# Altium schematic sheet hv_mux_tr_sw.SchDoc: WULPUS PRO
size A3; DrawnBy: Sergei Vostrikov; Organization: Integrated Systems Laboratory; Revision: 1.0.0; SheetNumber: 5; SheetTotal: 8
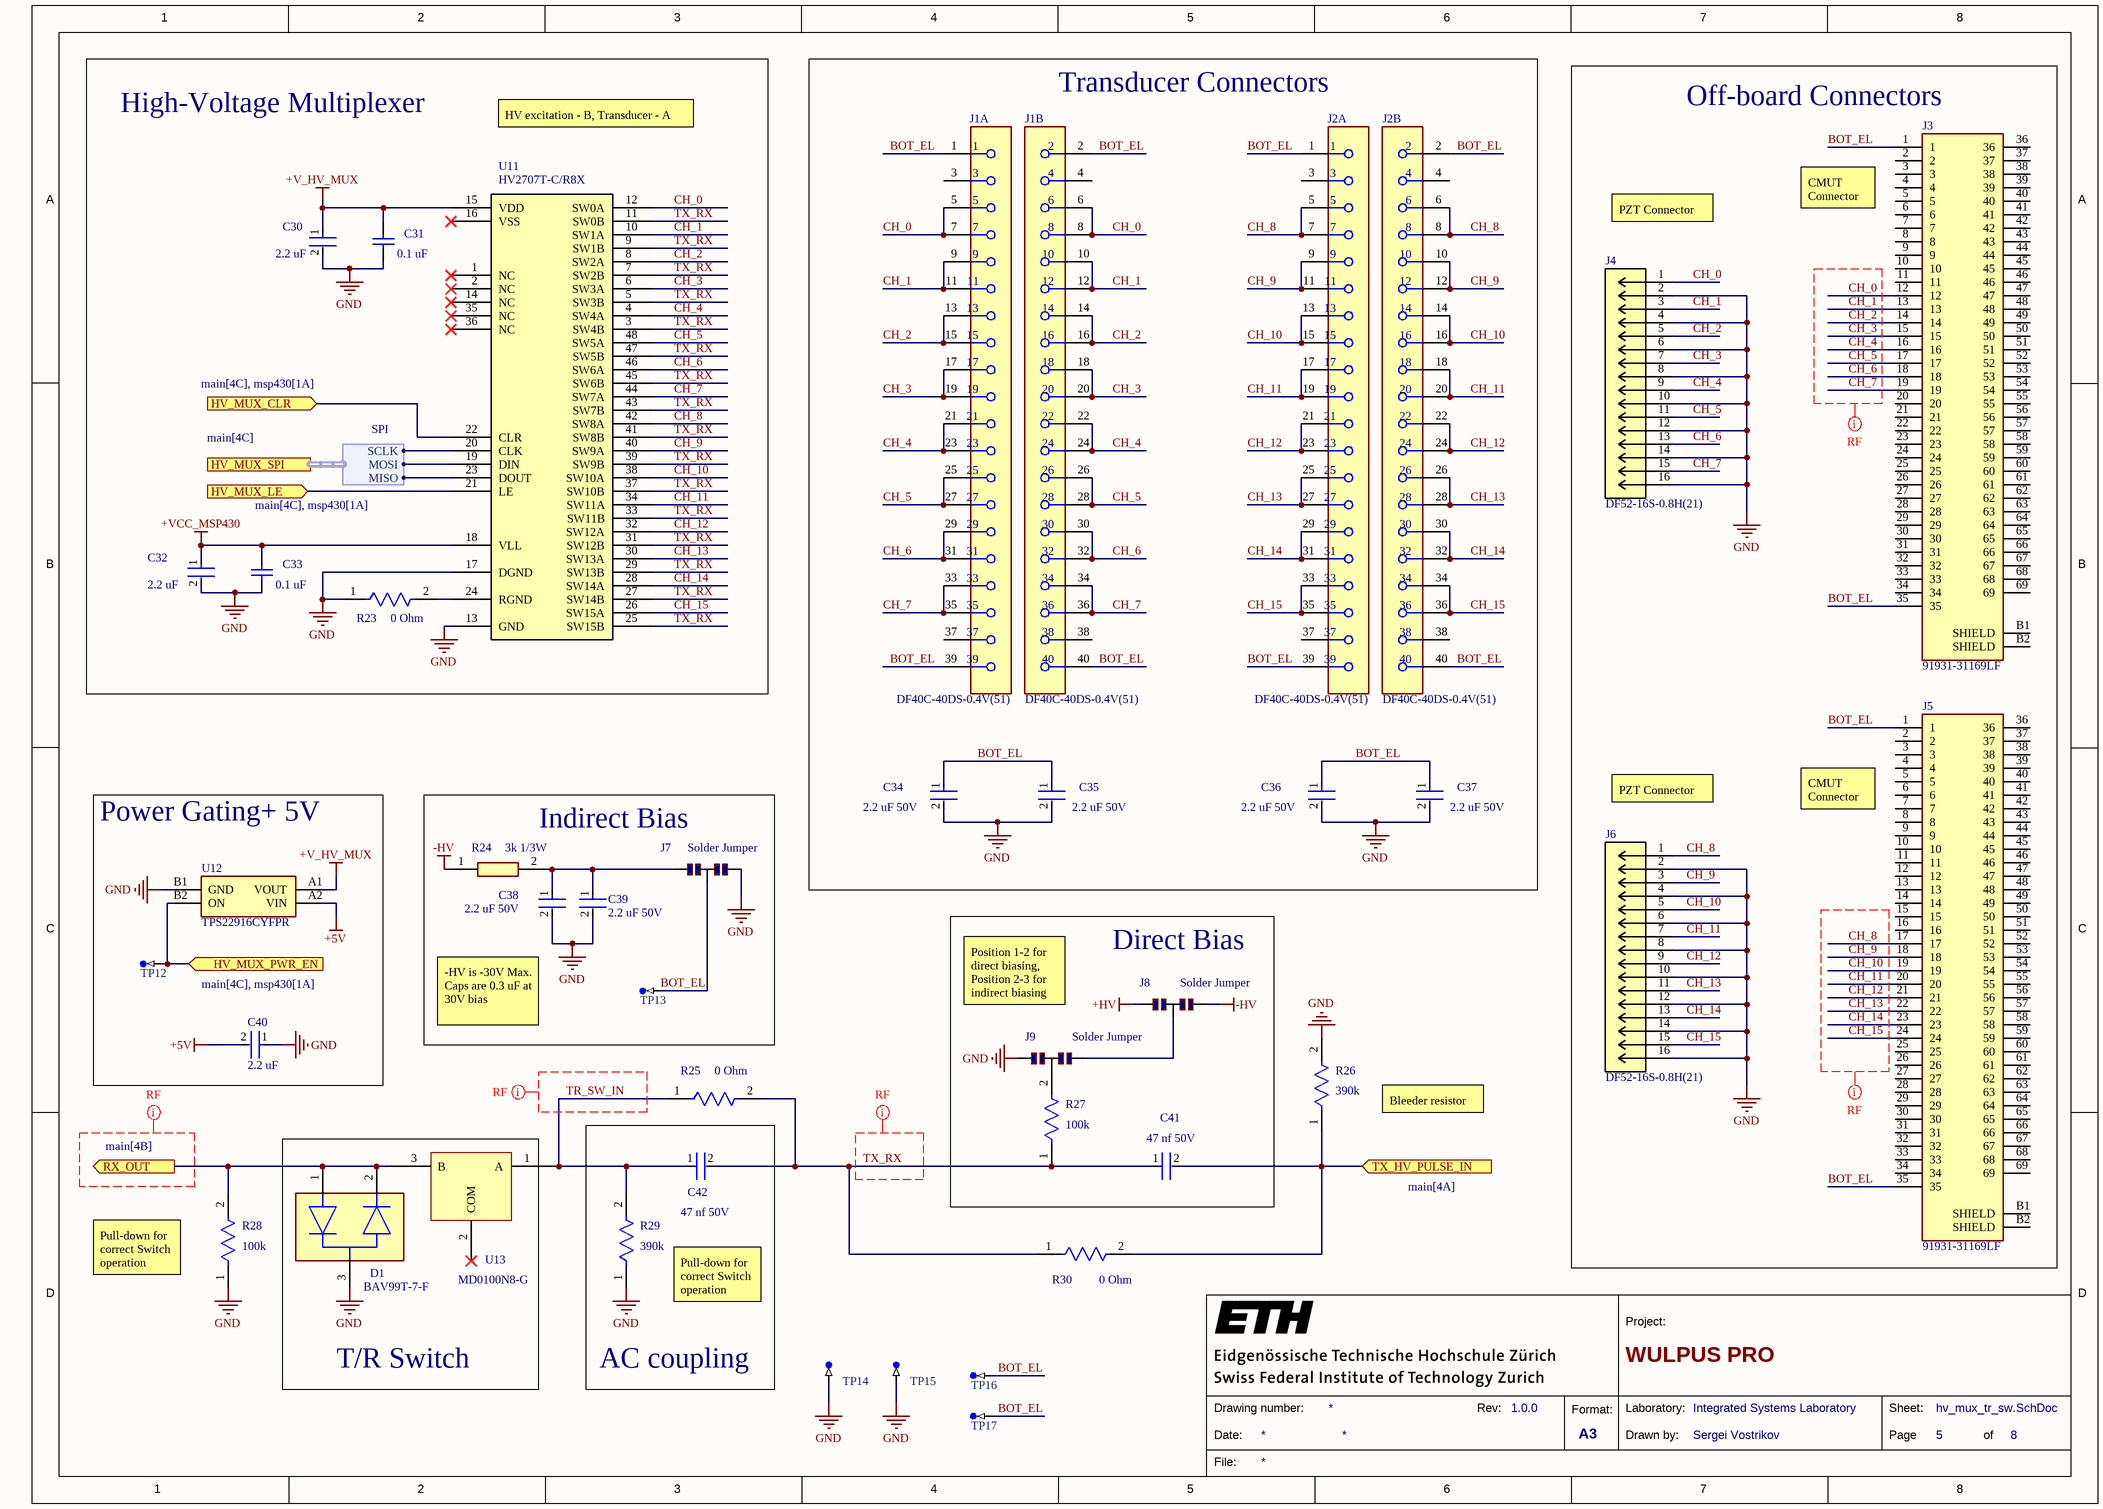
[diagram p0: hv_mux_tr_sw.SchDoc]

## Parts
C30  2.2 uF  [FP-C1005-050-0_15-0_1-MFG]
C31  0.1 uF  [CAPC1005X55X30LL05T10]
C32  2.2 uF  [FP-C1005-050-0_15-0_1-MFG]
C33  0.1 uF  [CAPC1005X55X30LL05T10]
C34  2.2 uF 50V  [FP-GRM188-0_2-IPC_B]
C35  2.2 uF 50V  [FP-GRM188-0_2-IPC_B]
C36  2.2 uF 50V  [FP-GRM188-0_2-IPC_B]
C37  2.2 uF 50V  [FP-GRM188-0_2-IPC_B]
C38  2.2 uF 50V  [FP-GRM188-0_2-IPC_B]
C39  2.2 uF 50V  [FP-GRM188-0_2-IPC_B]
C40  2.2 uF  [FP-C1005-050-0_15-0_1-MFG]
C41  47 nf 50V  [FP-GRM155-0_05-IPC_C]
C42  47 nf 50V  [FP-GRM155-0_05-IPC_C]
D1  BAV99T-7-F  [FP-SOT523-MFG]
J1  DF40C-40DS-0.4V(51)  [FP-DF40C-40DS-0_4V_51-MFG]  (parts A,B of 2)
J2  DF40C-40DS-0.4V(51)  [FP-DF40C-40DS-0_4V_51-MFG]  (parts A,B of 2)
J3  91931-31169LF  [FRAMETOME_91931-31169LF]
J4  DF52-16S-0.8H(21)  [CONN_DF52-16S-0.8H(21)_HIR]
J5  91931-31169LF  [FRAMETOME_91931-31169LF]
J6  DF52-16S-0.8H(21)  [CONN_DF52-16S-0.8H(21)_HIR]
J7  Solder Jumper  [Jumper 3 pins]  (no BOM)
J8  Solder Jumper  [Jumper 3 pins]  (no BOM)
J9  Solder Jumper  [Jumper 3 pins]  (no BOM)
R23  0 Ohm  [FP-CRCW0402-e3-IPC_C]
R24  3k 1/3W  [ERJP03_PA3_(0603)]
R25  0 Ohm  [FP-CRCW0402-e3-IPC_C]
R26  390k  [FP-RC1005-MFG]
R27  100k  [FP-ERJ2RK-IPC_C]
R28  100k  [FP-ERJ2RK-IPC_C]
R29  390k  [FP-RC1005-MFG]
R30  0 Ohm  [FP-CRCW0402-e3-IPC_C]
TP12  TP-SM-C-100  [TP-SM-C-100]  (value not drawn)  (no BOM)
TP13  TP-SM-C-100  [TP-SM-C-100]  (value not drawn)  (no BOM)
TP14  TP-SM-C-100  [TP-SM-C-100]  (value not drawn)  (no BOM)
TP15  TP-SM-C-100  [TP-SM-C-100]  (value not drawn)  (no BOM)
TP16  TP-SM-C-100  [TP-SM-C-100]  (value not drawn)  (no BOM)
TP17  TP-SM-C-100  [TP-SM-C-100]  (value not drawn)  (no BOM)
U11  HV2707T-C/R8X  [LQFP48_7X7MC_MCH]
U12  TPS22916CYFPR  [BGA4C40P2X2_78X78X50]
U13  MD0100N8-G  [AMP_PHA-1+]

## Blocks framed on the sheet
High-Voltage Multiplexer: C30-C33 R23 U11
Transducer Connectors: C34-C37 J1 J2
Off-board Connectors: J3-J6
Power Gating+ 5V: C40 TP12 U12
Indirect Bias: C38 C39 J7 R24 TP13
Direct Bias: C41 J8 J9 R27
T/R Switch: D1 U13
AC coupling: C42 R29

## Ports
HV_MUX_CLR (in, see main[4C], msp430[1A]), HV_MUX_LE (in, see main[4C], msp430[1A]), HV_MUX_PWR_EN (in, see main[4C], msp430[1A]), HV_MUX_SPI (harness SPI, see main[4C]), RX_OUT (out, see main[4B]), TX_HV_PULSE_IN (in, see main[4A])

## Harnesses
SPI: SCLK, MOSI, MISO

## Nets
+5V: C40.2 U12.A2(VIN)
+HV: J8.1
+V_HV_MUX: C30.1 C31.2 U11.15(VDD) U12.A1(VOUT)
+VCC_MSP430: C32.1 C33.2 U11.18(VLL)
-HV: J8.3 R24.1
GND: C30.2 C31.1 C32.2 C33.1 C34.2 C35.2 C36.2 C37.2 C38.2 C39.2 C40.1 D1.3 J4.2 J4.4 J4.6 J4.8 J4.10 J4.12 J4.14 J4.16 J6.2 J6.4 J6.6 J6.8 J6.10 J6.12 J6.14 J6.16 J7.3 J9.1 R23.1 R26.2 R28.1 R29.1 TP14.1 TP15.1 U11.13(GND) U11.17(DGND) U12.B1(GND)
BOT_EL: C34.1 C35.1 C36.1 C37.1 J1.1 J1.2 J1.39 J1.40 J2.1 J2.2 J2.39 J2.40 J3.1 J3.35 J5.1 J5.35 J7.2 TP13.1 TP16.1 TP17.1
CH_0: J1.5 J1.6 J1.7 J1.8 J3.12 J4.1 U11.12(SW0A)
CH_1: J1.9 J1.10 J1.11 J1.12 J3.13 J4.3 U11.10(SW1A)
CH_2: J1.13 J1.14 J1.15 J1.16 J3.14 J4.5 U11.8(SW2A)
CH_3: J1.17 J1.18 J1.19 J1.20 J3.15 J4.7 U11.6(SW3A)
CH_4: J1.21 J1.22 J1.23 J1.24 J3.16 J4.9 U11.4(SW4A)
CH_5: J1.25 J1.26 J1.27 J1.28 J3.17 J4.11 U11.48(SW5A)
CH_6: J1.29 J1.30 J1.31 J1.32 J3.18 J4.13 U11.46(SW6A)
CH_7: J1.33 J1.34 J1.35 J1.36 J3.19 J4.15 U11.44(SW7A)
CH_8: J2.5 J2.6 J2.7 J2.8 J5.17 J6.1 U11.42(SW8A)
CH_9: J2.9 J2.10 J2.11 J2.12 J5.18 J6.3 U11.40(SW9A)
CH_10: J2.13 J2.14 J2.15 J2.16 J5.19 J6.5 U11.38(SW10A)
CH_11: J2.17 J2.18 J2.19 J2.20 J5.20 J6.7 U11.34(SW11A)
CH_12: J2.21 J2.22 J2.23 J2.24 J5.21 J6.9 U11.32(SW12A)
CH_13: J2.25 J2.26 J2.27 J2.28 J5.22 J6.11 U11.30(SW13A)
CH_14: J2.29 J2.30 J2.31 J2.32 J5.23 J6.13 U11.28(SW14A)
CH_15: J2.33 J2.34 J2.35 J2.36 J5.24 J6.15 U11.26(SW15A)
HV_MUX_CLR: U11.22(CLR) ; port HV_MUX_CLR
HV_MUX_LE: U11.21(LE) ; port HV_MUX_LE
HV_MUX_PWR_EN: TP12.1 U12.B2(ON) ; port HV_MUX_PWR_EN
RX_OUT: D1.1 D1.2 R28.2 U13.3(B) ; port RX_OUT
TR_SW_IN: C42.1 R25.1 R29.2 U13.1(A)
TX_HV_PULSE_IN: C41.2 R26.1 R30.2 ; port TX_HV_PULSE_IN
TX_RX: C41.1 C42.2 R25.2 R27.1 R30.1 U11.3(SW4B) U11.5(SW3B) U11.7(SW2B) U11.9(SW1B) U11.11(SW0B) U11.25(SW15B) U11.27(SW14B) U11.29(SW13B) U11.31(SW12B) U11.33(SW11B) U11.37(SW10B) U11.39(SW9B) U11.41(SW8B) U11.43(SW7B) U11.45(SW6B) U11.47(SW5B)
NetC38_1: C38.1 C39.1 J7.1 R24.2
NetJ8_2: J8.2 J9.3
NetJ9_2: J9.2 R27.2
NetR23_2: R23.2 U11.24(RGND)
NetU11_19: U11.19(DIN) ; port HV_MUX_SPI.MOSI
NetU11_20: U11.20(CLK) ; port HV_MUX_SPI.SCLK
NetU11_23: U11.23(DOUT) ; port HV_MUX_SPI.MISO

Not connected (* = marked no-connect by the designer): J1 3 4 37 38; J2 3 4 37 38; J3 2 3 4 5 6 7 8 9 10 11 20 21 22 23 24 25 26 27 28 29 30 31 32 33 34 36 37 38 39 40 41 42 43 44 45 46 47 48 49 50 51 52 53 54 55 56 57 58 59 60 61 62 63 64 65 66 67 68 69 B1(SHIELD) B2(SHIELD); J5 2 3 4 5 6 7 8 9 10 11 12 13 14 15 16 25 26 27 28 29 30 31 32 33 34 36 37 38 39 40 41 42 43 44 45 46 47 48 49 50 51 52 53 54 55 56 57 58 59 60 61 62 63 64 65 66 67 68 69 B1(SHIELD) B2(SHIELD); U11 1(NC)* 2(NC)* 14(NC)* 16(VSS)* 35(NC)* 36(NC)*; U13 2(COM)*

## Layout directives
net class RF: (no net found under the mark), CH_0, CH_1, CH_2, CH_3, CH_4, CH_5, CH_6, CH_7, CH_8, CH_9, CH_10, CH_11, CH_12, CH_13, CH_14, CH_15, TR_SW_IN, TX_RX

## Notes on the sheet
- HV excitation - B, Transducer - A
- PZT Connector
- (near J3) CMUT
  Connector
- (near J5) CMUT
  Connector
- -HV is -30V Max. Caps are 0.3 uF at 30V bias
- Position 1-2 for direct biasing, Position 2-3 for indirect biasing
- Bleeder resistor
- (near R28) Pull-down for correct Switch operation
- (near R29) Pull-down for correct Switch operation
- 1
- 2
- 3
- 4
- 5
- 6
- 7
- 8
- A
- B
- C
- D
- Project:
- Date:
- Drawing number:
- Rev:
- Format:
- A3
- Drawn by:
- Laboratory:
- Page
- Sheet:
- of
- File:

## Library data of the parts
C30 C32 C40 = CMP-08246-004344-1: C1005X7S1A225K050BC; Capacitance: 2.2uF; Dielectric: X7S; Dielectric Material: Ceramic; Voltage Rating: 10V; Tolerance: 10%; Mount: Surface Mount; Height: 0.5mm; Package Quantity: 1; Depth: 0.5mm; RoHS Compliant: Yes; Length: 1mm; Thickness: 0.022inch; Packaging: Tape and Reel; Case Code (Imperial): 0402; Resistor Type: Ceramic; Case/Package: 0402; Min Operating Temperature: -55°C; Series: C; Weight: 2.3E-05oz; Width: 0.02inch; Voltage Rating (DC): 10V; Case Code (Metric): 1005; Max Operating Temperature: 125°C; Termination: SMD/SMT; Lead Free: Lead Free
C31 C33 = CMP-0001-00074-2: C0402C104K4RACTU; Manufacturer: Kemet; Part Number: C0402C104K4RACTU
C34-C39 = CMP-06035-000704-1: GRM188R61H225ME11; Capacitance: 2.2uF; Dielectric: X5R; Tolerance: 20%; Weight: 0.000222oz; Min Operating Temperature: -55°C; Voltage Rating (DC): 50V; Case Code (Imperial): 0603; Thickness: 0.039inch; Height: 0.8mm; Termination: SMD/SMT; Resistor Type: Ceramic; Case/Package: 0603; Package Quantity: 4000; Length: 0.063inch; Lead Free: Lead Free; Max Operating Temperature: 85°C; Packaging: Tape and Reel; Width: 0.031inch; Voltage Rating: 50V; Mount: Surface Mount; Case Code (Metric): 1608
C41 C42 = CMP-06035-054161-1: GRM155R71H473ME14D; Tolerance: 20%; Capacitance: 47nF; Dielectric: X7R; Termination: SMD/SMT; Package Quantity: 10000; Min Operating Temperature: -55°C; Height: 0.5mm; Case Code (Imperial): 0402; Resistor Type: Ceramic; Case Code (Metric): 1005; Voltage Rating (DC): 50V; Mount: Surface Mount; Case/Package: 0402; Packaging: Tape and Reel; Thickness: 0.022inch; Max Operating Temperature: 125°C; Weight: 0.000212oz; Width: 0.5mm; Length: 0.039inch; Voltage Rating: 50V
D1 = CMP-12791-000024-1: DIODE ARRAY GP 85V 75MA SOT523; Manufacturer: Diodes Inc.; Capacitance: 1.5pF; Value: 1.5pF; Standoff Height: 0mm; Peak Reverse Current: 2uA; Max Surge Forward Current: 0.5A; Max Junction Temp: +150°C; Device Class L1: Discrete Semiconductors; Automotive: No; Temperature: -65°C to +150°C; ComponentLink2Description: Datasheet; Package: SOT523; Manufacturer Part Number: BAV99T-7-F; Forward Current: 75mA; Max Repetitive Reverse Voltage: 85V; Device Class L3: Rectifier Diodes; Octopart: https://octopart.com/bav99t-7-f-diodes+inc.-326340; ComponentLink2URL: https://www.diodes.com/assets/Datasheets/ds30260.pdf; Lead Free: Yes; Digikey Description: DIODE ARRAY GP 85V 75MA SOT523; Reverse Voltage: 85V; Footprint Url: https://www.diodes.com/assets/Package-Files/SOT523.pdf; Category: Diode; RoHS: TRUE; Mouser Description: BAV99T Series 4 A 85 V 150 mW Surface Mount Fast Switching Diode - SOT-523; Device Class L2: Diodes; Height: 0.9mm; Temperature Range Low: -65°C; Temperature Range High: +150°C
J1 J2 = CMP-11605-000009-1: CONN RCPT 40POS SMD GOLD; Manufacturer: Hirose; Current Rating: 0.3A; Standoff Height: 0mm; Voltage Rating: 30V; Conn Gender: Female; Is Female: yes; Conn Orientation: Vertical; Pitch: 0.4mm; Number Of Contacts: 40; Manufacturer Part Number: DF40C-40DS-0.4V(51); Device Class L2: Board to Board Connectors; ComponentLink2URL: https://www.hirose.com/product/document?clcode=CL0684-4008-7-51&productname=DF40C-40DS-0.4V(51)&series=DF40&documenttype=SpecSheet&lang=en&documentid=0000427780; Contact Material: Gold,Nickel; Lead Free: Yes; Temperature: -35°C to +85°C; Number Of Rows: 2; Footprint Url: https://www.hirose.com/product/document?clcode=CL0684-4008-7-51&productname=DF40C-40DS-0.4V(51)&series=DF40&documenttype=2DDrawing&lang=en&documentid=0001001229; ComponentLink2Description: Datasheet; Category: Conn; Temperature Range High: +85°C; Device Class L1: Connectors; Package: 0; Digikey Description: CONN RCPT 40POS SMD GOLD; Device Class L3: unset; Height: 1.65mm; Octopart: https://octopart.com/df40c-40ds-0.4v%2851%29-hirose-19073526; RoHS: TRUE; Temperature Range Low: -35°C; Automotive: No
J3 J5 = 91931-31169LF: Conn; Rect; Industrial; MezzanineRECP; 69Cnts; SMT; I-IndustrialSeries; Package: None; Price: None; Value: *; MP: 91931-31169LF; Availability: Unavailable
J4 J6 = DF52-16S-0.8H(21): No Description Available; Mfr_Name: Hirose; Copyright: Copyright (C) 2022 Ultra Librarian. All rights reserved.; Manufacturer_Part_Number: DF52-16S-0.8H(21); RefDes: RefDes; Type: DEV
J7-J9 = CMP-00467-6: Solder Jumper 3 Pads; Technology: SMT
R23 R25 R30 = CMP-2002-08122-2: CRCW04020000Z0ED; Tolerance: 5%; Max Power Dissipation: 63mW; Voltage Rating: 50V; Temperature Coefficient: 100ppm/°C; Resistance: 0mR; Contact Plating: Tin; Height: 0.35mm; Radiation Hardening: No; Features: Automotive AEC-Q200; Composition: Thick Film; Width: 0.5mm; Weight: 2.3E-05oz; Termination: SMD/SMT; Packaging: Tape and Reel; Mount: Surface Mount; Case Code (Metric): 1005; Military Standard: Not; Min Operating Temperature: -55°C; Number of Terminations: 2; Package Quantity: 1; Case Code (Imperial): 0402; Depth: 0.5mm; Max Operating Temperature: 155°C; Case/Package: 0402; Power Rating: 63mW; Lead Free: Lead Free; Voltage Rating (DC): 50V; Length: 1mm
R24 = ERJ-PA3J302V: Manufacturer_Name: Panasonic; Datasheet Link: https://industrial.panasonic.com/cdbs/www-data/pdf/RDO0000/AOA0000C331.pdf; Height: 0.55mm; Manufacturer_Part_Number: ERJ-PA3J302V; Mouser Part Number: 667-ERJ-PA3J302V; Mouser Price/Stock: https://www.mouser.co.uk/ProductDetail/Panasonic/ERJ-PA3J302V?qs=BzJM0faLVqU1ZJAPCjWnWA%3D%3D
R26 R29 = CMP-13261-002896-1: RC1005F394CS; Voltage Rating (DC): 50V; Tolerance: 1%; Max Power Dissipation: 63mW; Resistance: 390kR; Temperature Coefficient: 100ppm/°C; Lead Free: Lead Free; Case/Package: 0402; Radiation Hardening: No; Length: 0.039inch; Depth: 0.5mm; Composition: Thick Film; Number of Terminations: 2; Height: 0.016inch; Packaging: Tape and Reel; Case Code (Imperial): 0402; Width: 0.02inch; Features: Moisture Resistant; Contact Plating: Tin; Min Operating Temperature: -55°C; Max Operating Temperature: 155°C; Case Code (Metric): 1005; Military Standard: Not
R27 R28 = CMP-2002-00608-4: ERJ-2RKF1003X; Resistance: 100kR; Voltage Rating (DC): 50V; Tolerance: 1%; Power Rating: 100mW; Temperature Coefficient: 100ppm/°C; Case/Package: 0402; Length: 1mm; Package Quantity: 1; Radiation Hardening: No; Case Code (Metric): 1005; Contact Plating: Tin; Mount: Surface Mount; Depth: 0.5mm; Max Operating Temperature: 155°C; Lead Free: Lead Free; Width: 0.5mm; Composition: Thick Film; Case Code (Imperial): 0402; Termination: SMD/SMT; Number of Pins: 2; Height: 0.35mm; Voltage Rating: 50V; Military Standard: Not; REACH SVHC: No SVHC; Packaging: Tape and Reel; Min Operating Temperature: -55°C; Max Power Dissipation: 100mW; Features: Automotive AEC-Q200; Number of Terminations: 2
TP12-TP17 = CMP-0484-00002-1: Test Point, Surface Mount, Circular, Pad Diameter 1 mm
U11 = HV2707T-C/R8X: 16-CH 200V No Hv Bias Switch (SPST), 2 Bleed Resistor 48 LQFP 7X7X1.4MM T/r Rohs Compliant: Yes; Manufacturer: Microchip; Supplier 1: Digi-Key; RoHS: Yes; Category: Decoders and Multiplexers; Stock 1: 440; Pricing 1: 1=19.01000, 25=15.84720, 100=14.65500 (USD); Manufacturer Part Number: HV2707T-C/R8X
U12 = TPS22916CYFPR: TPS22916 5.5-V, 2-A Ultra-Low Leakage Load Switch; Manufacturer_Name: Texas Instruments; Geometry.Height: 0.5mm; Manufacturer_Part_Number: TPS22916CYFPR; Arrow Part Number: TPS22916CYFPR; Arrow Price/Stock: https://www.arrow.com/en/products/tps22916cyfpr/texas-instruments?utm_currency=USD&region=nac; Datasheet Link: http://www.ti.com/lit/gpn/tps22916
U13 = MD0100